# Altium project TP2_PCB.PrjPcb
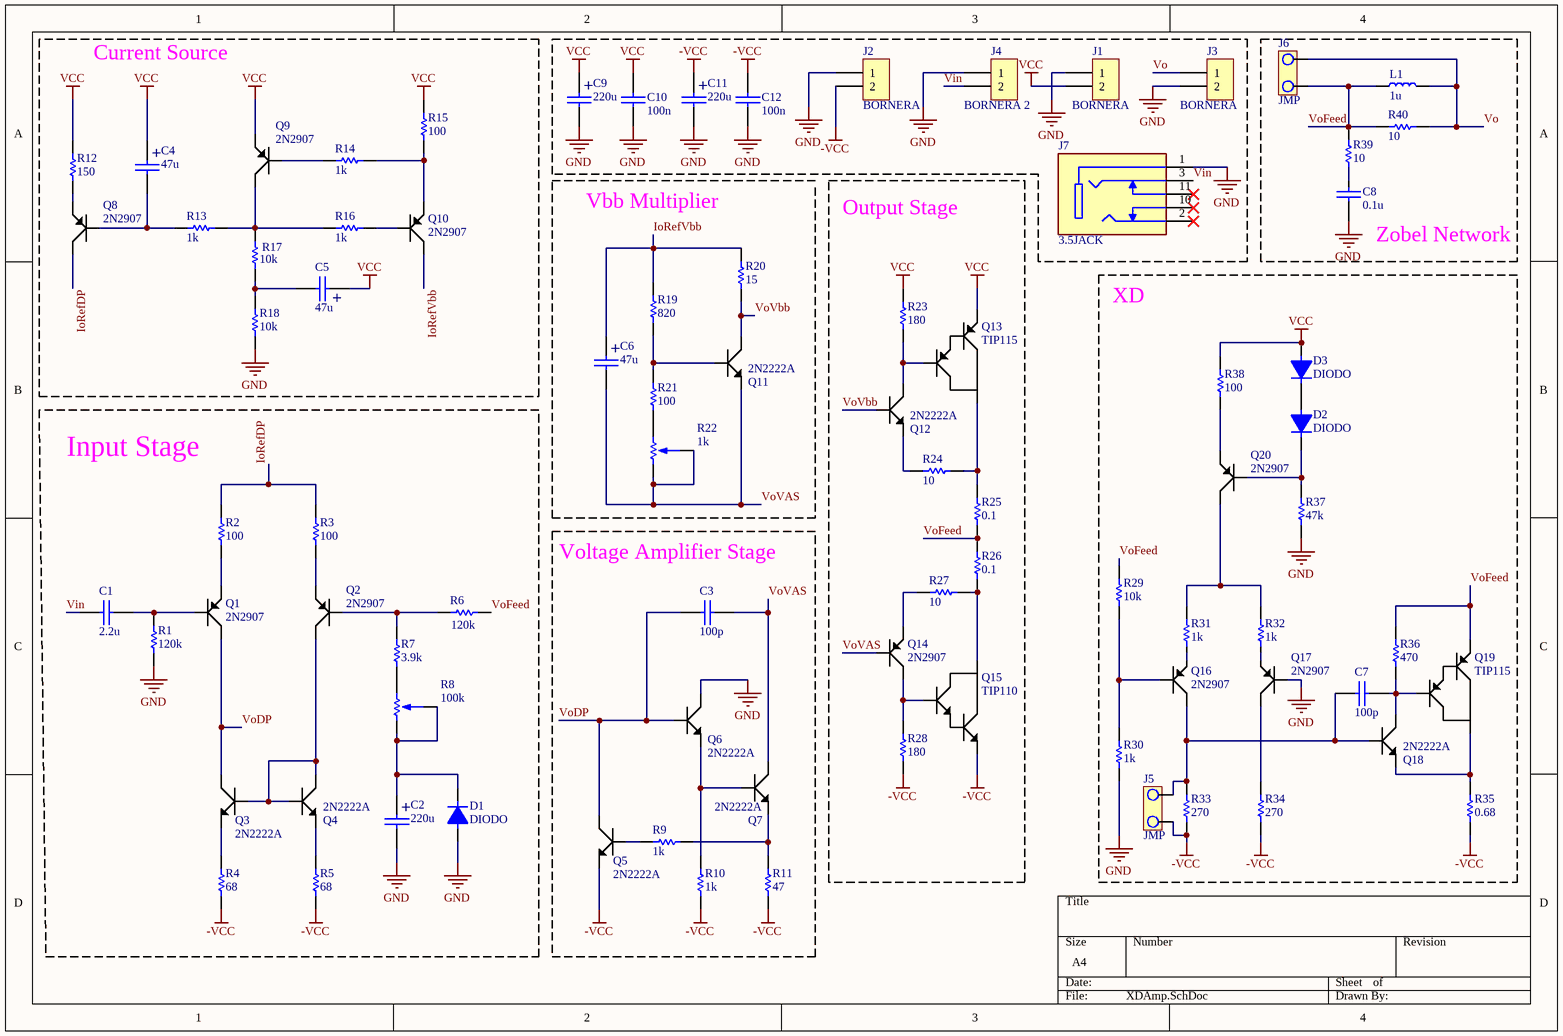
[diagram p0: XDAmp.SchDoc]
1 sheet, 83 parts. Net scope: global (net labels, ports and power ports of the same name join across sheets).
Board file: XDAmpPCB.PcbDoc

## Sheet XDAmp.SchDoc
size A4

### Parts
C1  2.2u  [CAP100]
C2  220u  [CAP300RP]
C3  100p  [0805CAP]
C4  47u  [CAP300RP]
C5  47u  [CAP300RP]
C6  47u  [CAP300RP]
C7  100p  [0805CAP]
C8  0.1u  [0805CAP]
C9  220u  [CAP300RP]
C10  100n  [0805CAP]
C11  220u  [CAP300RP]
C12  100n  [0805CAP]
D1  DIODO  [DO41]
D2  DIODO  [DO41]
D3  DIODO  [DO41]
J1  BORNERA  [BORNERA2]
J2  BORNERA  [BORNERA2]
J3  BORNERA  [BORNERA2]
J4  BORNERA 2  [BORNERA2]
J5  JMP  [JUMPER2]
J6  JMP  [JUMPER2]
J7  3.5JACK  [3.5JACK]
L1  1u  [RADIALIND]
Q1  2N2907  [TO-18]
Q2  2N2907  [TO-18]
Q3  2N2222A  [TO-18]
Q4  2N2222A  [TO-18]
Q5  2N2222A  [TO-18]
Q6  2N2222A  [TO-18]
Q7  2N2222A  [TO-18]
Q8  2N2907  [TO-18]
Q9  2N2907  [TO-18]
Q10  2N2907  [TO-18]
Q11  2N2222A  [TO-18]
Q12  2N2222A  [TO-18]
Q13  TIP115  [TO-220]
Q14  2N2907  [TO-18]
Q15  TIP110  [TO-220]
Q16  2N2907  [TO-18]
Q17  2N2907  [TO-18]
Q18  2N2222A  [TO-18]
Q19  TIP115  [TO-220]
Q20  2N2907  [TO-18]
R1  120k  [0805]
R2  100  [0805]
R3  100  [0805]
R4  68  [0805]
R5  68  [0805]
R6  120k  [0805]
R7  3.9k  [0805]
R8  100k  [POTENCIOMETRO]
R9  1k  [0805]
R10  1k  [0805]
R11  47  [0805]
R12  150  [0805]
R13  1k  [0805]
R14  1k  [0805]
R15  100  [0805]
R16  1k  [0805]
R17  10k  [0805]
R18  10k  [0805]
R19  820  [0805]
R20  15  [0805]
R21  100  [0805]
R22  1k  [PRESET V]
R23  180  [0805]
R24  10  [0805]
R25  0.1  [RES1200]
R26  0.1  [RES1200]
R27  10  [0805]
R28  180  [0805]
R29  10k  [0805]
R30  1k  [0805]
R31  1k  [0805]
R32  1k  [0805]
R33  270  [0805]
R34  270  [0805]
R35  0.68  [RES400]
R36  470  [0805]
R37  47k  [0805]
R38  100  [0805]
R39  10  [0805]
R40  10  [0805]

### Blocks framed on the sheet
Current Source: C4 C5 Q8-Q10 R12-R18
Zobel Network: C8 J6 L1 R39 R40
Output Stage: Q12-Q15 R23-R28
XD: C7 D2 D3 J5 Q16-Q20 R29-R38
Input Stage: C1 C2 D1 Q1-Q4 R1-R8
Voltage Amplifier Stage: C3 Q5-Q7 R9-R11

### Nets
-VCC: C11.1 C12.1 J2.2 J5.2 Q5.1 Q15.3 R4.1 R5.1 R10.1 R11.1 R28.2 R33.1 R34.1 R35.1
GND: C2.2 C8.1 C9.2 C10.2 C11.2 C12.2 D1.1 J1.1 J2.1 J3.2 J4.1 J7.1 Q6.3 Q17.2 R1.1 R18.2 R30.1 R37.1
VCC: C4.1 C5.1 C9.1 C10.1 D3.1 J1.2 Q9.1 Q13.3 R12.2 R15.1 R23.1 R38.2
IoRefDP: Q8.3 R2.2 R3.2
IoRefVbb: C6.1 Q10.3 R19.1 R20.1
Vin: C1.1 J4.2 J7.3
Vo: J3.1 J6.1 L1.2 R40.1
VoDP: C3.2 Q1.3 Q3.3 Q5.3 Q6.2
VoFeed: J6.2 L1.1 Q19.3 R6.1 R25.1 R26.2 R29.2 R36.2 R39.1 R40.2
VoVAS: C3.1 C6.2 Q7.3 Q11.1 Q14.2 R22.2 R22.3
VoVbb: Q11.3 Q12.2 R20.2
NetC1_2: C1.2 Q1.2 R1.2
NetC2_1: C2.1 D1.2 R8.2 R8.3
NetC4_2: C4.2 Q8.2 R13.2
NetC5_2: C5.2 R17.2 R18.1
NetC7_1: C7.1 J5.1 Q16.3 Q18.2 R33.2
NetC7_2: C7.2 Q18.3 Q19.1 R36.1
NetC8_2: C8.2 R39.2
NetD2_1: D2.1 D3.2
NetD2_2: D2.2 Q20.2 R37.2
NetQ1_1: Q1.1 R2.1
NetQ2_1: Q2.1 R3.1
NetQ2_2: Q2.2 R6.2 R7.1
NetQ2_3: Q2.3 Q3.2 Q4.2 Q4.3
NetQ3_1: Q3.1 R4.2
NetQ4_1: Q4.1 R5.2
NetQ5_2: Q5.2 R9.2
NetQ6_1: Q6.1 Q7.2 R10.2
NetQ7_1: Q7.1 R9.1 R11.2
NetQ8_1: Q8.1 R12.1
NetQ9_2: Q9.2 R14.2
NetQ9_3: Q9.3 R13.1 R16.2 R17.1
NetQ10_1: Q10.1 R14.1 R15.2
NetQ10_2: Q10.2 R16.1
NetQ11_2: Q11.2 R19.2 R21.1
NetQ12_1: Q12.1 R24.1
NetQ12_3: Q12.3 Q13.1 R23.2
NetQ13_2: Q13.2 R24.2 R25.2
NetQ14_1: Q14.1 R27.1
NetQ14_3: Q14.3 Q15.1 R28.1
NetQ15_2: Q15.2 R26.1 R27.2
NetQ16_1: Q16.1 R31.1
NetQ16_2: Q16.2 R29.1 R30.2
NetQ17_1: Q17.1 R32.1
NetQ17_3: Q17.3 R34.2
NetQ18_1: Q18.1 Q19.2 R35.2
NetQ20_1: Q20.1 R38.1
NetQ20_3: Q20.3 R31.2 R32.2
NetR7_2: R7.2 R8.1
NetR21_2: R21.2 R22.1

Not connected (* = marked no-connect by the designer): J7 2* 10* 11*

### Notes on the sheet
- (near R20) Vbb Multiplier
- (in symbol CAPPOL) +

### Library data of the parts
C1 C3 C7 C8 C10 C12 = CAP: Capacitor SMD 4.7nF
C2 C4-C6 C9 C11 = CAPPOL
J1-J3 = BORNERA 2
J5 J6 = JUMPER
J7 = 3.5JACK: 3.5 mm Right-Angle Stereo Jack, 5 Pin PCB Mount, Non-Threaded; MP: SJ1-3525N; Package: None; Price: None; Value: *; Availability: Unavailable
L1 = INDUCTOR_1
Q3-Q7 Q11 Q12 Q18 = 2N2222A: Manufacturer: JSMSEMI; Supplier: JLCPCB; Supplier Part Number: C916390
Q13 Q19 = TIP115: Manufacturer: JSMSEMI; Supplier: JLCPCB; Supplier Part Number: C916390
Q15 = TIP110: Manufacturer: JSMSEMI; Supplier: JLCPCB; Supplier Part Number: C916390
R1-R7 R9-R16 R18-R21 R23-R40 = RES: Resistencia SMD 470ohms
R8 = POTENCIOMETRO
R17 = RES
R22 = PRESET